# EAGLE schematic DuplexOptoIso (EAGLE 6.4)
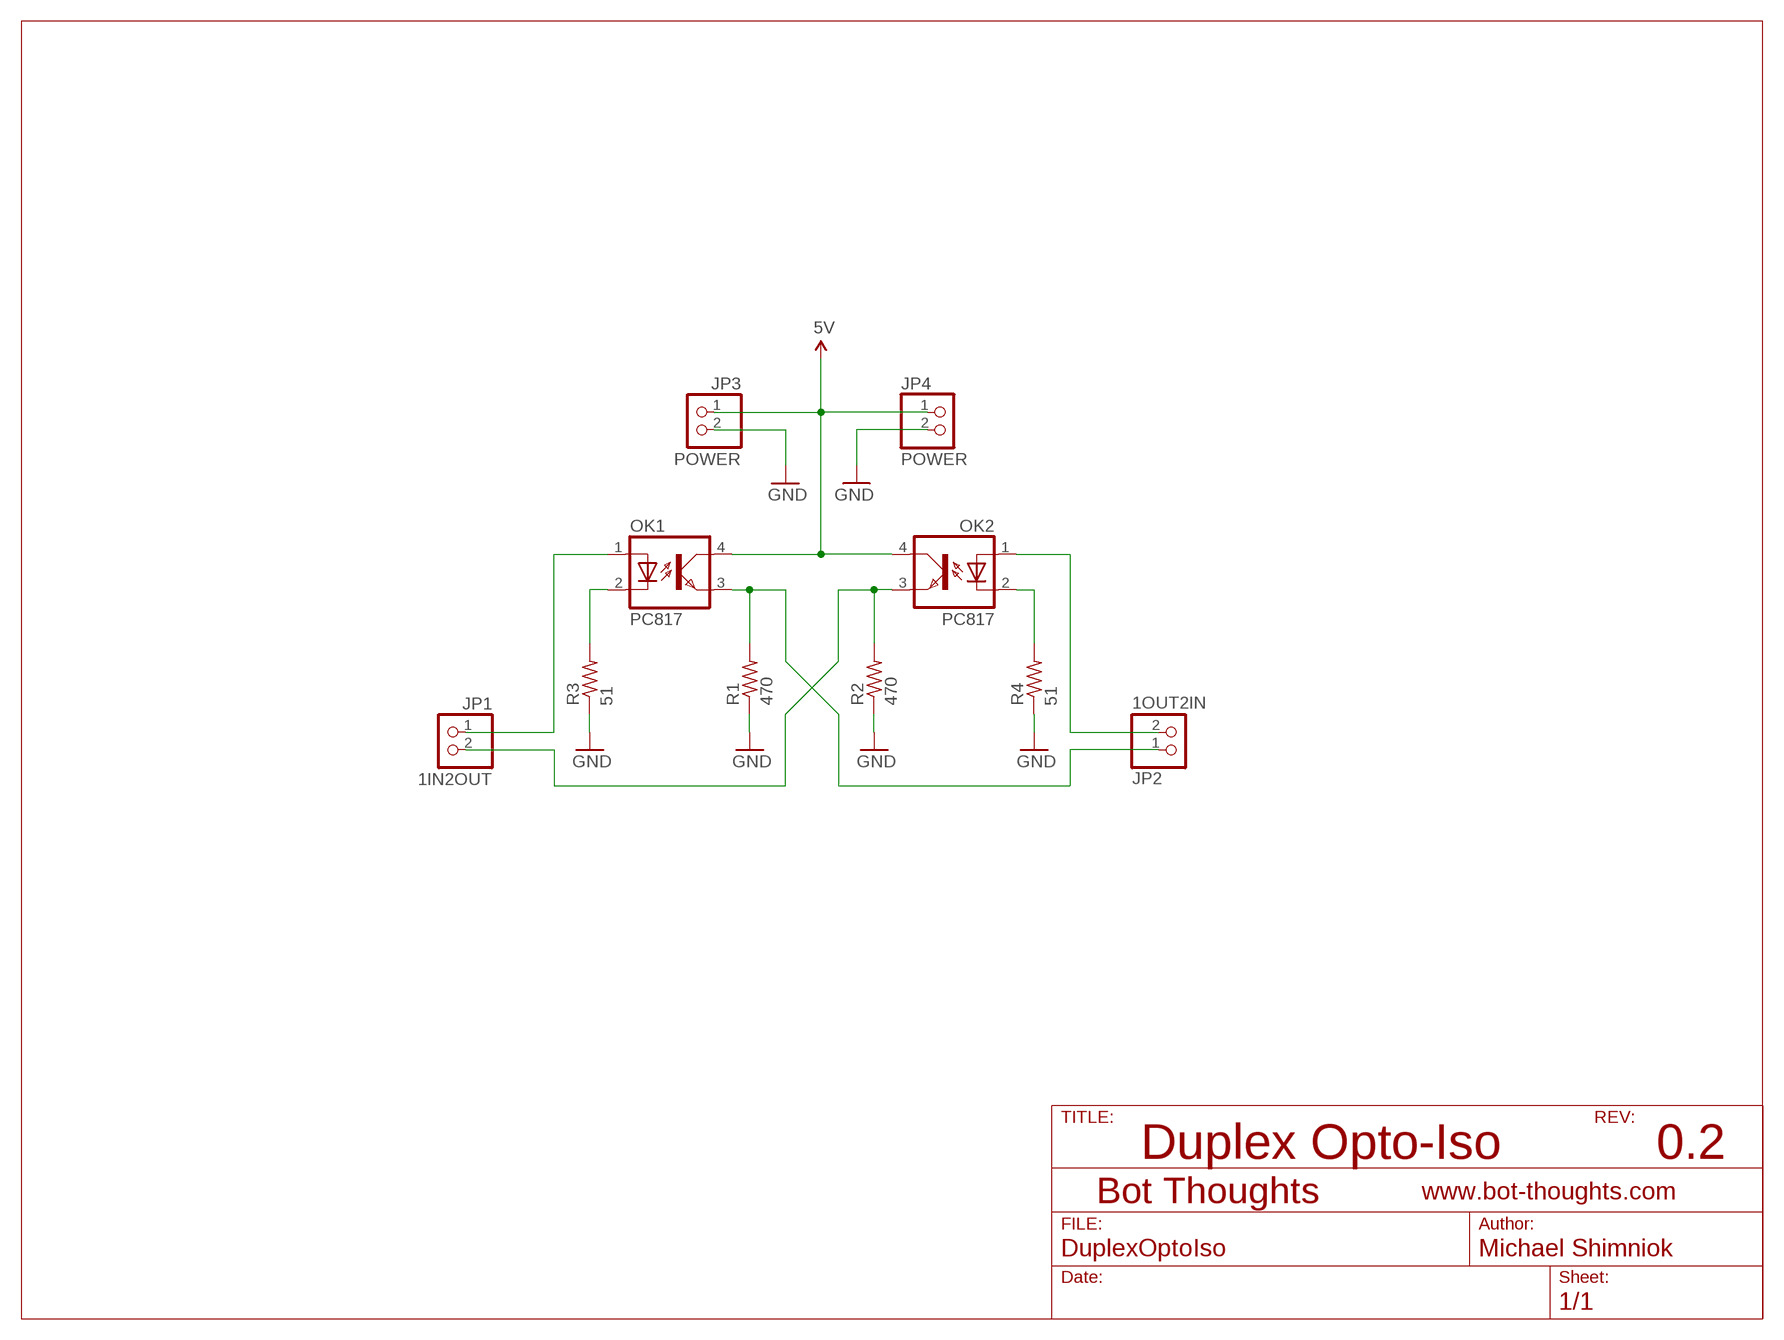
[diagram p0: schematic, sheet 1]

## Parts
JP1  1IN2OUT  PINHD-1X02_2.54-S  [1X02-S]
JP2  1OUT2IN  PINHD-1X02_2.54-S  [1X02-S]
JP3  POWER  PINHD-1X02_2.54-S  [1X02-S]
JP4  POWER  PINHD-1X02_2.54-S  [1X02-S]
OK1  PC817  [DIL04]
OK2  PC817  [DIL04]
R1  470  R-US_0204/5  [0204/5]
R2  470  R-US_0204/5  [0204/5]
R3  51  R-US_0204/5  [0204/5]
R4  51  R-US_0204/5  [0204/5]

## Nets
5V: JP3.1 JP4.1 OK1.4(COL) OK2.4(COL)
GND: JP3.2 JP4.2 R1.1 R2.1 R3.1 R4.1
IN1: JP1.1 OK1.1(A)
IN2: JP2.2 OK2.1(A)
N$5: OK1.2(C) R3.2
N$6: OK2.2(C) R4.2
OUT1: JP2.1 OK1.3(EMIT) R1.2
OUT2: JP1.2 OK2.3(EMIT) R2.2

## Notes on the sheet
- Duplex Opto-Iso | 0.2

## Library data of the parts
JP1-JP4 = pinhead-2:PINHD-1X02: PIN HEADER
OK1 OK2 = optocoupler:PC817: SHARP OPTO COUPLER; MPN: PC817X4J000F; OC_FARNELL: 9707727; OC_NEWARK: 97K7059
R1-R4 = rcl:R-US_: RESISTOR, American symbol